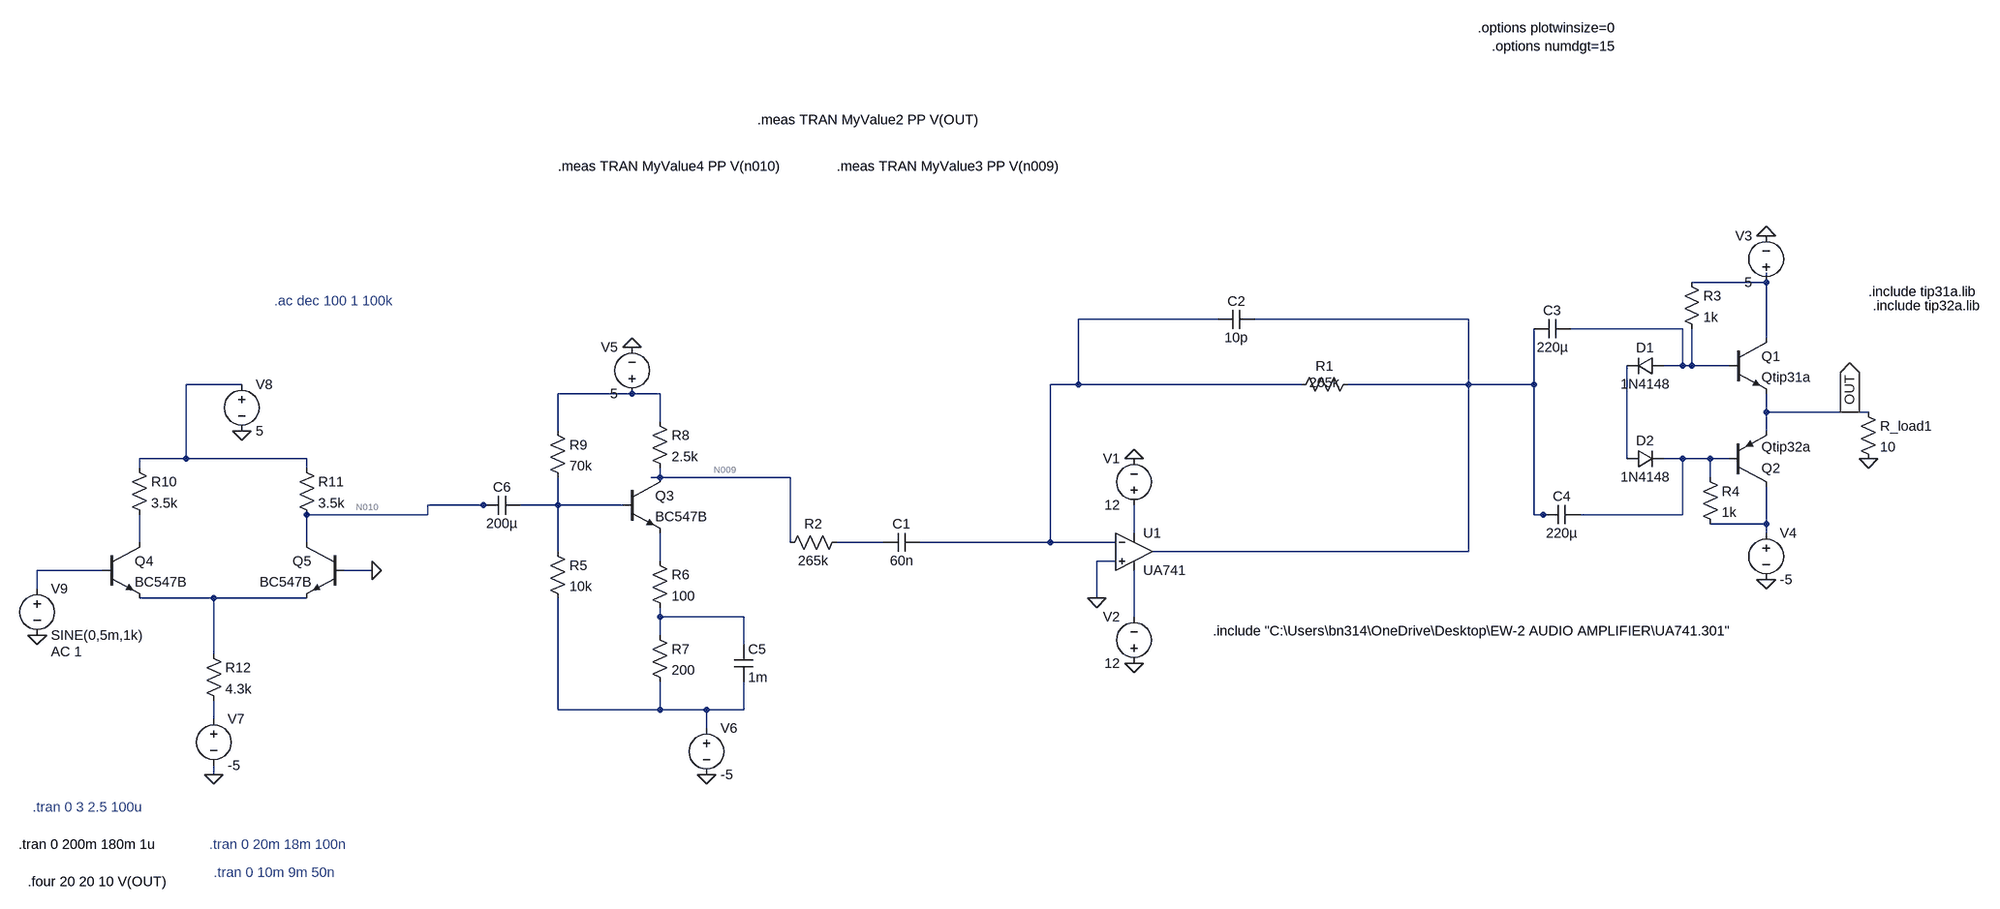
[diagram p0: schematic Final.asc]
Final.asc, the LTspice schematic file:
Version 4
SHEET 1 1120 728
WIRE -192 -320 -192 -336
WIRE -192 -320 -320 -320
WIRE -1136 -256 -1376 -256
WIRE -704 -256 -1072 -256
WIRE -336 -240 -528 -240
WIRE -192 -224 -192 -320
WIRE -336 -176 -336 -240
WIRE -336 -176 -368 -176
WIRE -320 -176 -320 -240
WIRE -320 -176 -336 -176
WIRE -256 -176 -320 -176
WIRE -2816 -144 -2912 -144
WIRE -1376 -144 -1376 -256
WIRE -1376 -144 -1424 -144
WIRE -992 -144 -1376 -144
WIRE -704 -144 -704 -256
WIRE -704 -144 -912 -144
WIRE -592 -144 -592 -240
WIRE -592 -144 -704 -144
WIRE -2144 -128 -2272 -128
WIRE -2096 -128 -2144 -128
WIRE -192 -96 -192 -128
WIRE -48 -96 -192 -96
WIRE -16 -96 -48 -96
WIRE -2096 -80 -2096 -128
WIRE -2272 -64 -2272 -128
WIRE -192 -64 -192 -96
WIRE -2912 -16 -2912 -144
WIRE -2912 -16 -2992 -16
WIRE -2704 -16 -2912 -16
WIRE -432 -16 -432 -176
WIRE -336 -16 -368 -16
WIRE -288 -16 -336 -16
WIRE -256 -16 -288 -16
WIRE -2992 0 -2992 -16
WIRE -2704 0 -2704 -16
WIRE -2096 16 -2096 0
WIRE -2096 16 -2112 16
WIRE -1872 16 -2096 16
WIRE -288 16 -288 -16
WIRE -2400 64 -2496 64
WIRE -2384 64 -2400 64
WIRE -2272 64 -2272 16
WIRE -2272 64 -2336 64
WIRE -2160 64 -2272 64
WIRE -2496 80 -2496 64
WIRE -2496 80 -2704 80
WIRE -592 80 -592 -144
WIRE -576 80 -592 80
WIRE -560 80 -576 80
WIRE -336 80 -336 -16
WIRE -336 80 -512 80
WIRE -192 96 -192 32
WIRE -192 96 -288 96
WIRE -1280 112 -1280 64
WIRE -192 112 -192 96
WIRE -2992 128 -2992 80
WIRE -2704 128 -2704 80
WIRE -1872 128 -1872 16
WIRE -1712 128 -1792 128
WIRE -1424 128 -1424 -144
WIRE -1424 128 -1648 128
WIRE -1312 128 -1424 128
WIRE -2272 144 -2272 64
WIRE -704 144 -704 -144
WIRE -704 144 -1248 144
WIRE -2096 160 -2096 112
WIRE -1312 160 -1344 160
WIRE -3056 176 -3168 176
WIRE -2592 176 -2640 176
WIRE -3168 208 -3168 176
WIRE -2864 224 -2992 224
WIRE -2704 224 -2864 224
WIRE -1344 224 -1344 160
WIRE -2096 256 -2096 240
WIRE -1952 256 -2096 256
WIRE -1280 256 -1280 176
WIRE -2096 288 -2096 256
WIRE -1952 304 -1952 256
WIRE -2864 320 -2864 224
WIRE -2272 416 -2272 224
WIRE -2096 416 -2096 368
WIRE -2096 416 -2272 416
WIRE -2016 416 -2096 416
WIRE -1952 416 -1952 368
WIRE -1952 416 -2016 416
WIRE -2864 432 -2864 400
WIRE -2016 448 -2016 416
WIRE -2864 528 -2864 512
FLAG -1344 224 0
FLAG -1280 -16 0
FLAG -1280 336 0
FLAG -16 -16 0
FLAG -192 -400 0
FLAG -192 192 0
FLAG -2144 -208 0
FLAG -2016 528 0
FLAG -2864 528 0
FLAG -2816 -64 0
FLAG -3168 288 0
FLAG -48 -96 OUT
IOPIN -48 -96 Out
FLAG -2592 176 0
SYMBOL res -896 -160 R90
WINDOW 0 0 56 VBottom 2
WINDOW 3 28 56 VBottom 2
SYMATTR InstName R1
SYMATTR Value 265k
SYMBOL cap -1648 112 R90
WINDOW 0 0 32 VBottom 2
WINDOW 3 32 32 VTop 2
SYMATTR InstName C1
SYMATTR Value 60n
SYMBOL cap -1072 -272 R90
WINDOW 0 0 32 VBottom 2
WINDOW 3 32 32 VTop 2
SYMATTR InstName C2
SYMATTR Value 10p
SYMBOL res -1776 112 R90
WINDOW 0 0 56 VBottom 2
WINDOW 3 32 56 VTop 2
SYMATTR InstName R2
SYMATTR Value 265k
SYMBOL OpAmps\\opamp2 -1280 80 R0
SYMATTR InstName U1
SYMATTR Value UA741
SYMBOL voltage -1280 80 R180
WINDOW 0 24 96 Left 2
WINDOW 3 24 16 Left 2
SYMATTR InstName V1
SYMATTR Value 12
SYMBOL voltage -1280 352 R180
WINDOW 0 24 96 Left 2
WINDOW 3 24 16 Left 2
WINDOW 123 0 0 Left 0
WINDOW 39 0 0 Left 0
SYMATTR InstName V2
SYMATTR Value 12
SYMBOL npn -256 -224 R0
SYMATTR InstName Q1
SYMATTR Value Qtip31a
SYMBOL pnp -256 32 M180
SYMATTR InstName Q2
SYMATTR Value Qtip32a
SYMBOL res -32 -112 R0
SYMATTR InstName R_load1
SYMATTR Value 10
SYMBOL voltage -192 -304 R180
WINDOW 0 24 96 Left 2
WINDOW 3 24 16 Left 2
WINDOW 123 0 0 Left 0
WINDOW 39 0 0 Left 0
SYMATTR InstName V3
SYMATTR Value 5
SYMBOL voltage -192 96 R0
WINDOW 123 0 0 Left 0
WINDOW 39 0 0 Left 0
SYMATTR InstName V4
SYMATTR Value -5
SYMBOL diode -368 -192 R90
WINDOW 0 0 32 VBottom 2
WINDOW 3 32 32 VTop 2
SYMATTR InstName D1
SYMATTR Value 1N4148
SYMBOL diode -432 0 R270
WINDOW 0 32 32 VTop 2
WINDOW 3 0 32 VBottom 2
SYMATTR InstName D2
SYMATTR Value 1N4148
SYMBOL res -336 -336 R0
SYMATTR InstName R3
SYMATTR Value 1k
SYMBOL res -304 0 R0
SYMATTR InstName R4
SYMATTR Value 1k
SYMBOL cap -528 -256 R90
WINDOW 0 0 32 VBottom 2
WINDOW 3 32 32 VTop 2
SYMATTR InstName C3
SYMATTR Value 220µ
SYMBOL cap -576 64 M90
WINDOW 0 0 32 VBottom 2
WINDOW 3 32 32 VTop 2
SYMATTR InstName C4
SYMATTR Value 220µ
SYMBOL res -2288 128 R0
SYMATTR InstName R5
SYMATTR Value 10k
SYMBOL voltage -2144 -112 R180
WINDOW 0 24 96 Left 2
WINDOW 3 24 16 Left 2
SYMATTR InstName V5
SYMATTR Value 5
SYMBOL npn -2160 16 R0
SYMATTR InstName Q3
SYMATTR Value BC547B
SYMBOL res -2112 144 R0
SYMATTR InstName R6
SYMATTR Value 100
SYMBOL res -2112 272 R0
SYMATTR InstName R7
SYMATTR Value 200
SYMBOL cap -1968 304 R0
SYMATTR InstName C5
SYMATTR Value 1m
SYMBOL res -2112 -96 R0
SYMATTR InstName R8
SYMATTR Value 2.5k
SYMBOL voltage -2016 432 R0
SYMATTR InstName V6
SYMATTR Value -5
SYMBOL cap -2336 48 R90
WINDOW 0 0 32 VBottom 2
WINDOW 3 32 32 VTop 2
SYMATTR InstName C6
SYMATTR Value 200µ
SYMBOL res -2288 -80 R0
SYMATTR InstName R9
SYMATTR Value 70k
SYMBOL npn -3056 128 R0
SYMATTR InstName Q4
SYMATTR Value BC547B
SYMBOL npn -2640 128 M0
SYMATTR InstName Q5
SYMATTR Value BC547B
SYMBOL res -3008 -16 R0
SYMATTR InstName R10
SYMATTR Value 3.5k
SYMBOL res -2720 -16 R0
SYMATTR InstName R11
SYMATTR Value 3.5k
SYMBOL res -2880 304 R0
SYMATTR InstName R12
SYMATTR Value 4.3k
SYMBOL voltage -2864 416 R0
SYMATTR InstName V7
SYMATTR Value -5
SYMBOL voltage -2816 -160 R0
SYMATTR InstName V8
SYMATTR Value 5
SYMBOL voltage -3168 192 R0
WINDOW 123 24 124 Left 2
WINDOW 39 0 0 Left 0
SYMATTR Value2 AC 1
SYMATTR InstName V9
SYMATTR Value SINE(0,5m,1k)
TEXT -1144 280 Left 2 !.include "C:\\Users\\bn314\\OneDrive\\Desktop\\EW-2 AUDIO AMPLIFIER\\UA741.301"
TEXT -16 -304 Left 2 !.include tip31a.lib
TEXT -8 -280 Left 2 !.include tip32a.lib
TEXT -3200 648 Left 2 !.tran 0 200m 180m 1u
TEXT -1928 -600 Left 2 !.meas TRAN MyValue2 PP V(OUT)
TEXT -3184 712 Left 2 !.four 20 20 10 V(OUT)
TEXT -1792 -520 Left 2 !.meas TRAN MyValue3 PP V(n009)
TEXT -688 -880 Left 2 !.options plotwinsize=0
TEXT -664 -848 Left 2 !.options numdgt=15
TEXT -2760 -288 Left 2 ;.ac dec 100 1 100k
TEXT -3176 584 Left 2 ;.tran 0 3 2.5 100u
TEXT -2872 648 Left 2 ;.tran 0 20m 18m 100n
TEXT -2864 696 Left 2 ;.tran 0 10m 9m 50n
TEXT -2272 -520 Left 2 !.meas TRAN MyValue4 PP V(n010)

The netlist it stands for:
* Final.asc
R1 N003 N002 265k
C1 N002 N015 60n
C2 N003 N002 10p
R2 N015 N009 265k
XU1 0 N002 N013 N020 N003 UA741  ; pins In+ In- V+ V- OUT
V1 N013 0 12
V2 0 N020 12
Q1 N001 N004 OUT 0 Qtip31a
Q2 N012 N008 OUT 0 Qtip32a
R_load1 OUT 0 10
V3 N001 0 5
V4 N012 0 -5
D1 N004 N007 1N4148
D2 N007 N008 1N4148
R3 N001 N004 1k
R4 N008 N012 1k
C3 N004 N003 220µ
C4 N003 N008 220µ
R5 N011 N021 10k
V5 N006 0 5
Q3 N009 N011 N016 0 BC547B
R6 N016 N019 100
R7 N019 N021 200
C5 N019 N021 1m
R8 N006 N009 2.5k
V6 N021 0 -5
C6 N011 N010 200µ
R9 N006 N011 70k
Q4 N014 N017 N018 0 BC547B
Q5 N010 0 N018 0 BC547B
R10 N005 N014 3.5k
R11 N005 N010 3.5k
R12 N018 N022 4.3k
V7 N022 0 -5
V8 N005 0 5
V9 N017 0 SINE(0,5m,1k) AC 1
.model D D
.lib standard.dio
.model NPN NPN
.model PNP PNP
.lib standard.bjt
.include "C:\Users\bn314\OneDrive\Desktop\EW-2 AUDIO AMPLIFIER\UA741.301"
.include tip31a.lib
.include tip32a.lib
.tran 0 200m 180m 1u
.meas TRAN MyValue2 PP V(OUT)
.four 20 20 10 V(OUT)
.meas TRAN MyValue3 PP V(n009)
.options plotwinsize=0
.options numdgt=15
* .ac dec 100 1 100k
* .tran 0 3 2.5 100u
* .tran 0 20m 18m 100n
* .tran 0 10m 9m 50n
.meas TRAN MyValue4 PP V(n010)
.backanno
.end